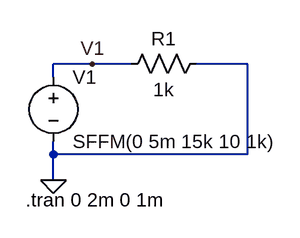
[diagram p0: schematic E5-Fuente-SFFM.asc]
E5-Fuente-SFFM.asc, the LTspice schematic file:
Version 4
SHEET 1 880 680
WIRE -2096 160 -2144 160
WIRE -2048 160 -2096 160
WIRE -1904 160 -1968 160
WIRE -2144 176 -2144 160
WIRE -2144 272 -2144 256
WIRE -1904 272 -1904 160
WIRE -1904 272 -2144 272
WIRE -2144 304 -2144 272
FLAG -2144 304 0
FLAG -2096 160 V1
SYMBOL res -1952 144 R90
WINDOW 0 0 56 VBottom 2
WINDOW 3 32 56 VTop 2
SYMATTR InstName R1
SYMATTR Value 1k
SYMATTR SpiceLine pwr=1
SYMBOL voltage -2144 160 R0
WINDOW 123 0 0 Left 0
WINDOW 39 0 0 Left 0
SYMATTR InstName V1
SYMATTR Value SFFM(0 5m 15k 10 1k)
TEXT -2178 328 Left 2 !.tran 0 2m 0 1m

The netlist it stands for:
* E5-Fuente-SFFM.asc
R1 0 V1 1k pwr=1
V1 V1 0 SFFM(0 5m 15k 10 1k)
.tran 0 2m 0 1m
.backanno
.end